# Altium schematic sheet 合体.schdoc
size A1
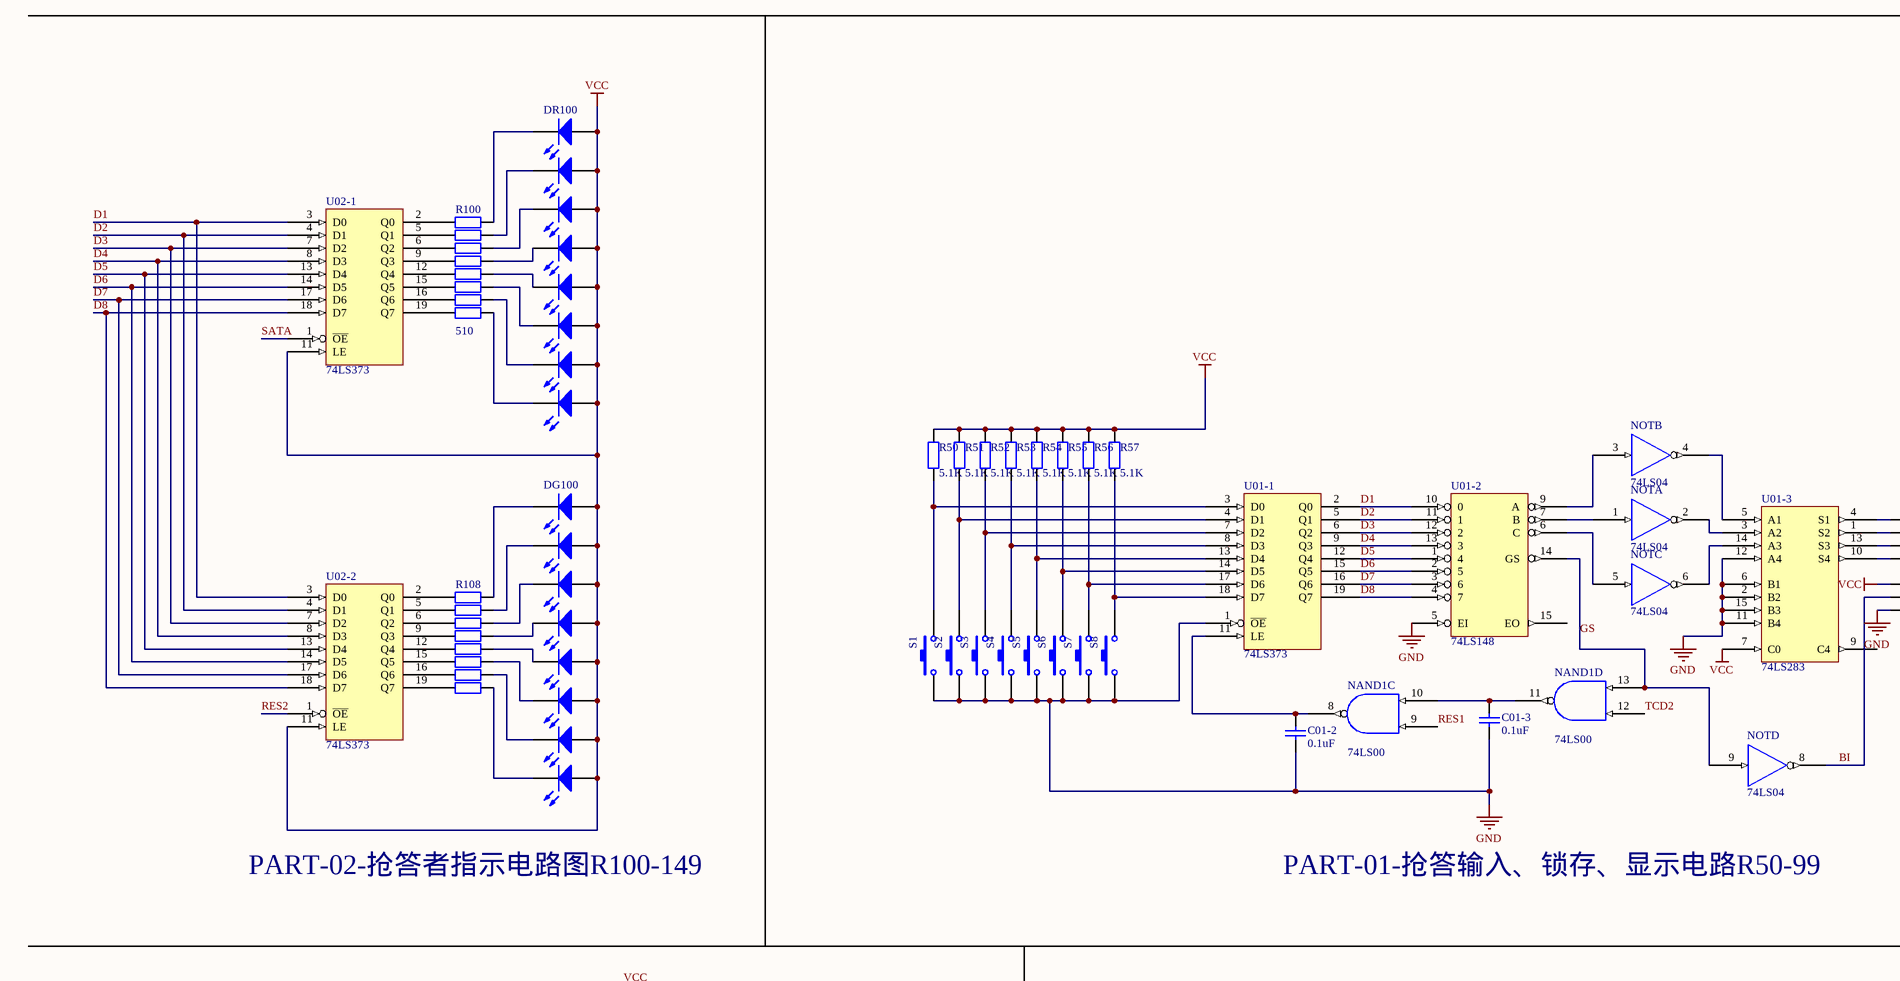
[diagram p0: 合体.schdoc, top left]
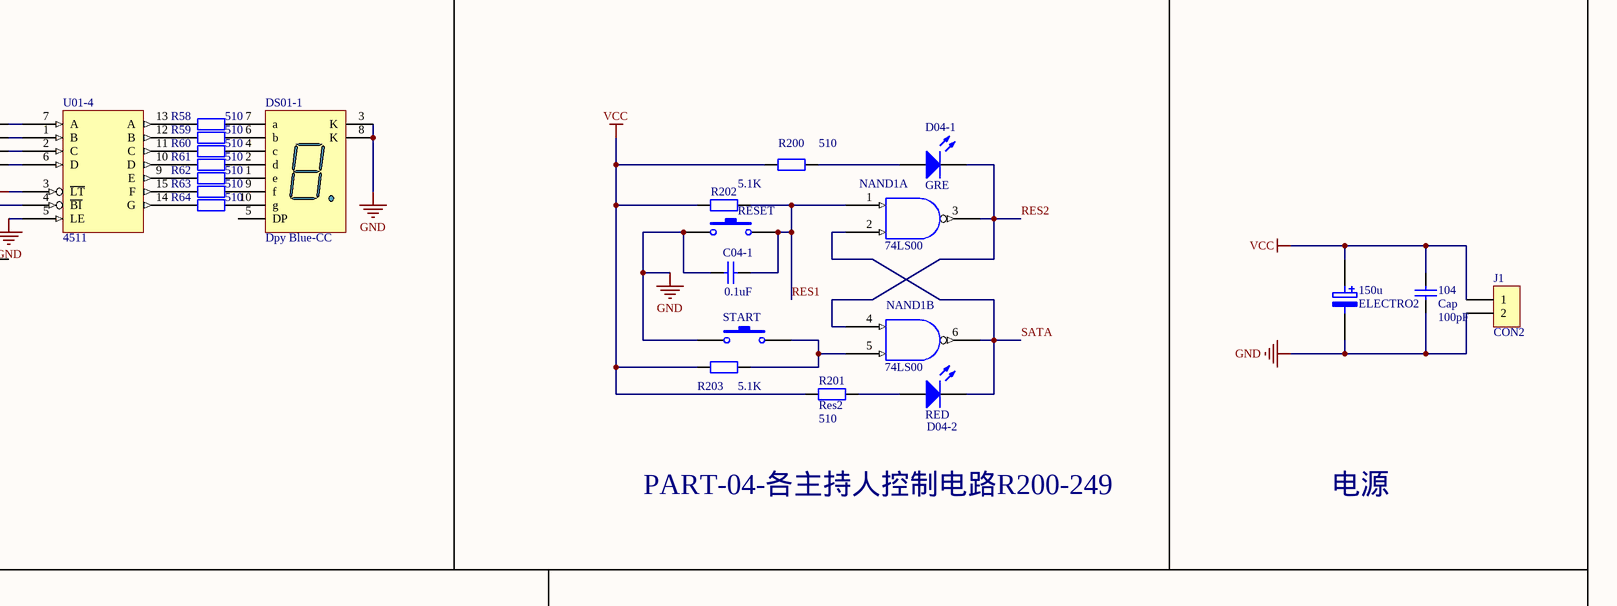
[diagram p1: 合体.schdoc, top right]
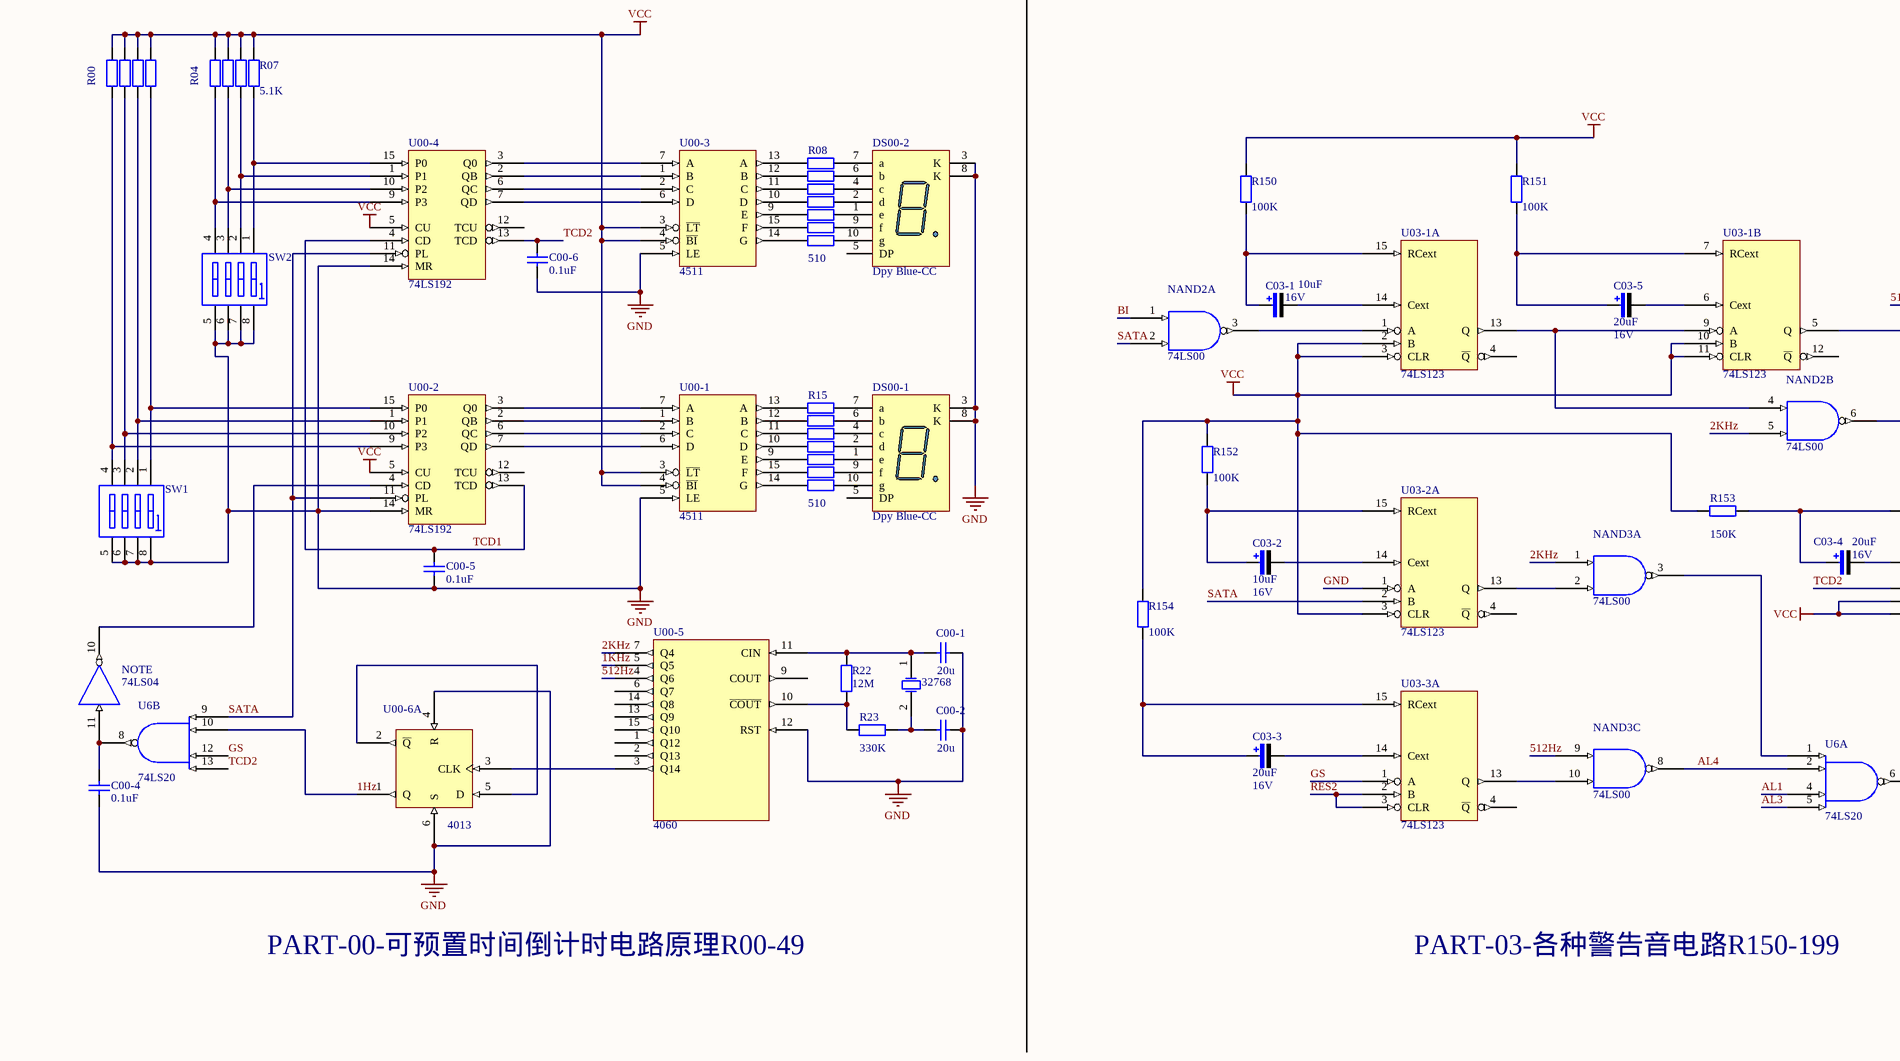
[diagram p2: 合体.schdoc, bottom left]
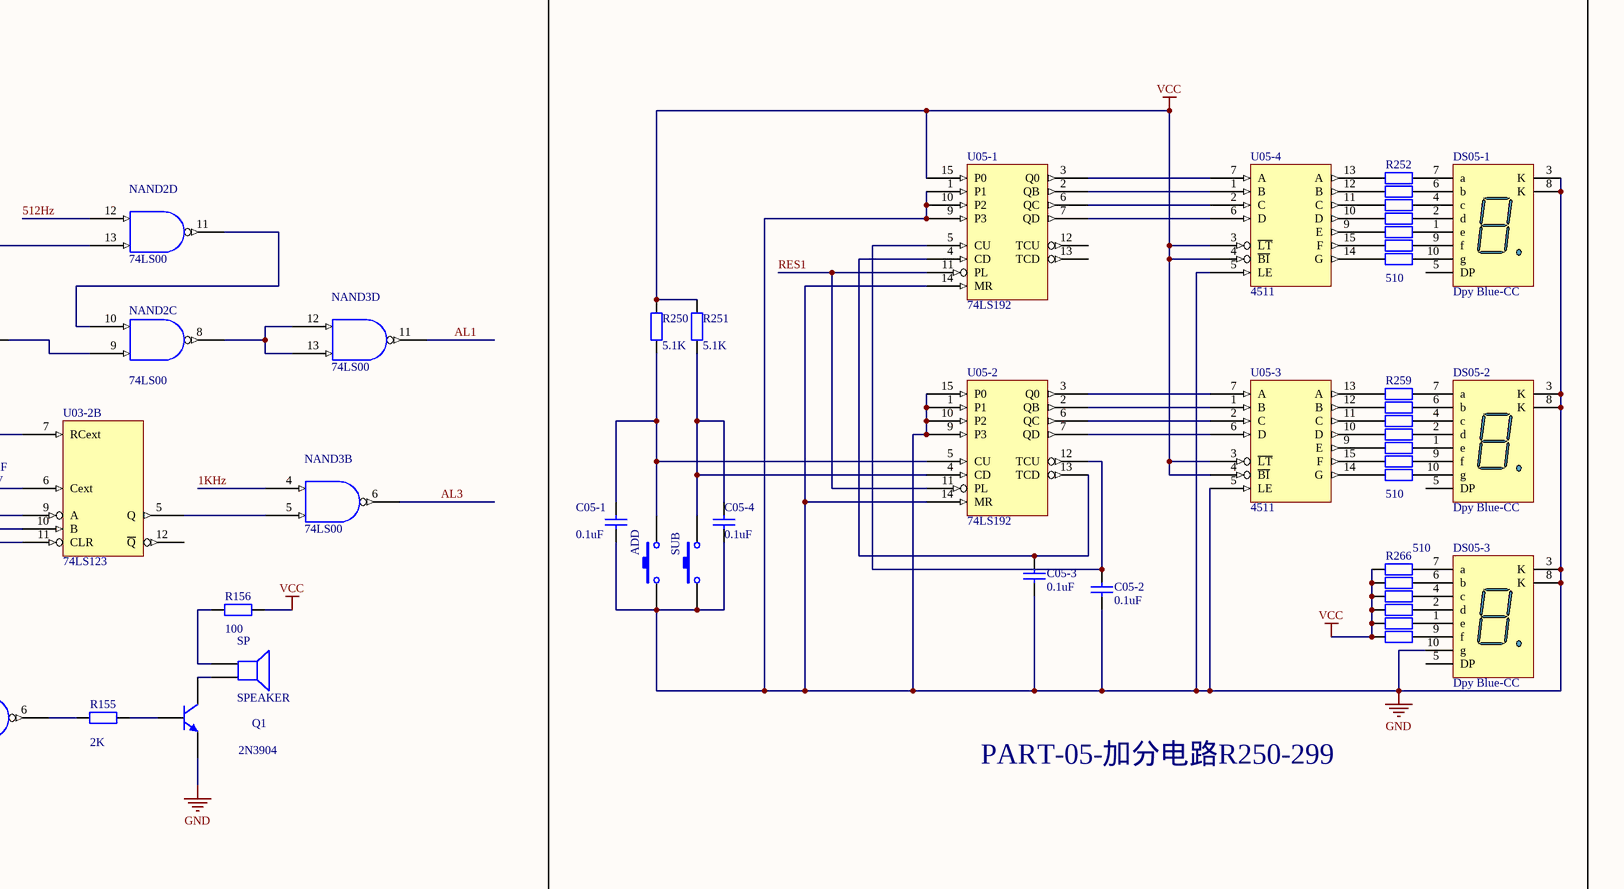
[diagram p3: 合体.schdoc, bottom right]

## Parts
104  Cap  value 100pF  [CAP0.2]
150u  ELECTRO2  [CAP-EL]
32768  XTAL  [XTAL-1]  (value not drawn)
ADD  SW-PB  [AN-S]  (value not drawn)
C00-1  value 20u  [CAP0.2]  (hidden comment: Cap)
C00-2  value 20u  [CAP0.2]  (hidden comment: Cap)
C00-4  value 0.1uF  [CAP0.2]  (hidden comment: Cap)
C00-5  value 0.1uF  [CAP0.2]  (hidden comment: Cap)
C00-6  value 0.1uF  [CAP0.2]  (hidden comment: Cap)
C01-2  value 0.1uF  [CAP0.2]  (hidden comment: Cap)
C01-3  value 0.1uF  [CAP0.2]  (hidden comment: Cap)
C03-1  value 10uF  Vol: 16V  [CAP-EL]  (hidden comment: Cap Pol)
C03-2  value 10uF  Vol: 16V  [CAP-EL]  (hidden comment: Cap Pol)
C03-3  value 20uF  Vol: 16V  [CAP-EL]  (hidden comment: Cap Pol)
C03-4  value 20uF  Vol: 16V  [CAP-EL]  (hidden comment: Cap Pol)
C03-5  value 20uF  Vol: 16V  [CAP-EL]  (hidden comment: Cap Pol)
C04-1  value 0.1uF  [CAP0.2]  (hidden comment: Cap)
C05-1  value 0.1uF  [CAP0.2]  (hidden comment: Cap)
C05-2  value 0.1uF  [CAP0.2]  (hidden comment: Cap)
C05-3  value 0.1uF  [CAP0.2]  (hidden comment: Cap)
C05-4  value 0.1uF  [CAP0.2]  (hidden comment: Cap)
D04-1  GRE  [LED-3]
D04-2  RED  [LED-3]
DG100  LED  [LED-3]  (value not drawn)
DG101  LED  [LED-3]  (value not drawn)
DG102  LED  [LED-3]  (value not drawn)
DG103  LED  [LED-3]  (value not drawn)
DG104  LED  [LED-3]  (value not drawn)
DG105  LED  [LED-3]  (value not drawn)
DG106  LED  [LED-3]  (value not drawn)
DG107  LED  [LED-3]  (value not drawn)
DR100  LED  [LED-3]  (value not drawn)
DR101  LED  [LED-3]  (value not drawn)
DR102  LED  [LED-3]  (value not drawn)
DR103  LED  [LED-3]  (value not drawn)
DR104  LED  [LED-3]  (value not drawn)
DR105  LED  [LED-3]  (value not drawn)
DR106  LED  [LED-3]  (value not drawn)
DR107  LED  [LED-3]  (value not drawn)
DS00-1  Dpy Blue-CC  [H]
DS00-2  Dpy Blue-CC  [H]
DS01-1  Dpy Blue-CC  [H]
DS05-1  Dpy Blue-CC  [H]
DS05-2  Dpy Blue-CC  [H]
DS05-3  Dpy Blue-CC  [H]
J1  CON2  [POWER PLUG2]
NAND1  74LS00  [DIP-14]  (parts A,B,C,D of 4)
NAND2  74LS00  [DIP-14]  (parts A,B,C,D of 4)
NAND3  74LS00  [DIP-14]  (parts A,B,C,D of 4)
NOT  74LS04  [DIP-14]  (parts A,B,C,D,E of 6)
Q1  2N3904  [NPN-2]
R00  Res2  [AXIAL-0.4]  (value not drawn)
R01  Res2  [AXIAL-0.4]  (value not drawn)
R02  Res2  [AXIAL-0.4]  (value not drawn)
R03  Res2  [AXIAL-0.4]  (value not drawn)
R04  Res2  [AXIAL-0.4]  (value not drawn)
R05  Res2  [AXIAL-0.4]  (value not drawn)
R06  Res2  [AXIAL-0.4]  (value not drawn)
R07  value 5.1K  [AXIAL-0.4]  (hidden comment: Res2)
R08  value 510  [AXIAL-0.4]  (hidden comment: Res2)
R09  Res2  [AXIAL-0.4]  (value not drawn)
R10  Res2  [AXIAL-0.4]  (value not drawn)
R11  Res2  [AXIAL-0.4]  (value not drawn)
R12  Res2  [AXIAL-0.4]  (value not drawn)
R13  Res2  [AXIAL-0.4]  (value not drawn)
R14  Res2  [AXIAL-0.4]  (value not drawn)
R15  value 510  [AXIAL-0.4]  (hidden comment: Res2)
R16  Res2  [AXIAL-0.4]  (value not drawn)
R17  Res2  [AXIAL-0.4]  (value not drawn)
R18  Res2  [AXIAL-0.4]  (value not drawn)
R19  Res2  [AXIAL-0.4]  (value not drawn)
R20  Res2  [AXIAL-0.4]  (value not drawn)
R21  Res2  [AXIAL-0.4]  (value not drawn)
R22  value 12M  [AXIAL-0.4]  (hidden comment: Res2)
R23  value 330K  [AXIAL-0.4]  (hidden comment: Res2)
R50  value 5.1K  [AXIAL-0.4]  (hidden comment: Res2)
R51  value 5.1K  [AXIAL-0.4]  (hidden comment: Res2)
R52  value 5.1K  [AXIAL-0.4]  (hidden comment: Res2)
R53  value 5.1K  [AXIAL-0.4]  (hidden comment: Res2)
R54  value 5.1K  [AXIAL-0.4]  (hidden comment: Res2)
R55  value 5.1K  [AXIAL-0.4]  (hidden comment: Res2)
R56  value 5.1K  [AXIAL-0.4]  (hidden comment: Res2)
R57  value 5.1K  [AXIAL-0.4]  (hidden comment: Res2)
R58  value 510  [AXIAL-0.4]  (hidden comment: Res2)
R59  value 510  [AXIAL-0.4]  (hidden comment: Res2)
R60  value 510  [AXIAL-0.4]  (hidden comment: Res2)
R61  value 510  [AXIAL-0.4]  (hidden comment: Res2)
R62  value 510  [AXIAL-0.4]  (hidden comment: Res2)
R63  value 510  [AXIAL-0.4]  (hidden comment: Res2)
R64  value 510  [AXIAL-0.4]  (hidden comment: Res2)
R100  value 510  [AXIAL-0.4]  (hidden comment: Res2)
R101  Res2  [AXIAL-0.4]  (value not drawn)
R102  Res2  [AXIAL-0.4]  (value not drawn)
R103  Res2  [AXIAL-0.4]  (value not drawn)
R104  Res2  [AXIAL-0.4]  (value not drawn)
R105  Res2  [AXIAL-0.4]  (value not drawn)
R106  Res2  [AXIAL-0.4]  (value not drawn)
R107  Res2  [AXIAL-0.4]  (value not drawn)
R108  Res2  [AXIAL-0.4]  (value not drawn)
R109  Res2  [AXIAL-0.4]  (value not drawn)
R110  Res2  [AXIAL-0.4]  (value not drawn)
R111  Res2  [AXIAL-0.4]  (value not drawn)
R112  Res2  [AXIAL-0.4]  (value not drawn)
R113  Res2  [AXIAL-0.4]  (value not drawn)
R114  Res2  [AXIAL-0.4]  (value not drawn)
R115  Res2  [AXIAL-0.4]  (value not drawn)
R150  value 100K  [AXIAL-0.4]  (hidden comment: Res2)
R151  value 100K  [AXIAL-0.4]  (hidden comment: Res2)
R152  value 100K  [AXIAL-0.4]  (hidden comment: Res2)
R153  value 150K  [AXIAL-0.4]  (hidden comment: Res2)
R154  value 100K  [AXIAL-0.4]  (hidden comment: Res2)
R155  value 2K  [AXIAL-0.4]  (hidden comment: Res2)
R156  value 100  [AXIAL-0.4]  (hidden comment: Res2)
R200  value 510  [AXIAL-0.4]  (hidden comment: Res2)
R201  Res2  value 510  [AXIAL-0.4]
R202  value 5.1K  [AXIAL-0.4]  (hidden comment: Res2)
R203  value 5.1K  [AXIAL-0.4]  (hidden comment: Res2)
R250  value 5.1K  [AXIAL-0.4]  (hidden comment: Res2)
R251  value 5.1K  [AXIAL-0.4]  (hidden comment: Res2)
R252  value 510  [AXIAL-0.4]  (hidden comment: Res2)
R253  Res2  [AXIAL-0.4]  (value not drawn)
R254  Res2  [AXIAL-0.4]  (value not drawn)
R255  Res2  [AXIAL-0.4]  (value not drawn)
R256  Res2  [AXIAL-0.4]  (value not drawn)
R257  Res2  [AXIAL-0.4]  (value not drawn)
R258  Res2  [AXIAL-0.4]  (value not drawn)
R259  value 510  [AXIAL-0.4]  (hidden comment: Res2)
R260  Res2  [AXIAL-0.4]  (value not drawn)
R261  Res2  [AXIAL-0.4]  (value not drawn)
R262  Res2  [AXIAL-0.4]  (value not drawn)
R263  Res2  [AXIAL-0.4]  (value not drawn)
R264  Res2  [AXIAL-0.4]  (value not drawn)
R265  Res2  [AXIAL-0.4]  (value not drawn)
R266  value 510  [AXIAL-0.4]  (hidden comment: Res2)
R267  Res2  [AXIAL-0.4]  (value not drawn)
R268  Res2  [AXIAL-0.4]  (value not drawn)
R269  Res2  [AXIAL-0.4]  (value not drawn)
R270  Res2  [AXIAL-0.4]  (value not drawn)
R271  Res2  [AXIAL-0.4]  (value not drawn)
RESET  SW-PB  [AN-S]  (value not drawn)
S1  SW-PB  [AN-S]  (value not drawn)
S2  SW-PB  [AN-S]  (value not drawn)
S3  SW-PB  [AN-S]  (value not drawn)
S4  SW-PB  [AN-S]  (value not drawn)
S5  SW-PB  [AN-S]  (value not drawn)
S6  SW-PB  [AN-S]  (value not drawn)
S7  SW-PB  [AN-S]  (value not drawn)
S8  SW-PB  [AN-S]  (value not drawn)
SP  SPEAKER  [RAD-0.2]
START  SW-PB  [AN-S]  (value not drawn)
SUB  SW-PB  [AN-S]  (value not drawn)
SW1  SW DIP-4  [DIP-8]  (value not drawn)
SW2  SW DIP-4  [DIP-8]  (value not drawn)
U00-1  4511  [DIP-16]
U00-2  74LS192  [DIP-16]
U00-3  4511  [DIP-16]
U00-4  74LS192  [DIP-16]
U00-5  4060  [DIP-16]
U00-6  4013  [DIP-14]  (part A of 2)
U01-1  74LS373  [DIP-20]
U01-2  74LS148  [DIP-16]
U01-3  74LS283  [DIP-16]
U01-4  4511  [DIP-16]
U02-1  74LS373  [DIP-20]
U02-2  74LS373  [DIP-20]
U03-1  74LS123  [DIP-16]  (parts A,B of 2)
U03-2  74LS123  [DIP-16]  (parts A,B of 2)
U03-3  74LS123  [DIP-16]  (part A of 2)
U05-1  74LS192  [DIP-16]
U05-2  74LS192  [DIP-16]
U05-3  4511  [DIP-16]
U05-4  4511  [DIP-16]
U6  74LS20  [DIP-14]  (parts A,B of 2)

## Nets
GND: 104.1 150u.2 ADD.1 C00-1.2 C00-2.2 C00-4.1 C00-5.1 C00-6.1 C01-2.1 C01-3.1 C04-1.1 C05-1.1 C05-2.1 C05-3.1 C05-4.1 DS00-1.3(K) DS00-1.8(K) DS00-2.3(K) DS00-2.8(K) DS01-1.3(K) DS01-1.8(K) DS05-1.3(K) DS05-1.8(K) DS05-2.3(K) DS05-2.8(K) DS05-3.3(K) DS05-3.8(K) DS05-3.10(g) J1.2 NAND1.7(GND) NAND2.7(GND) NAND3.7(GND) NOT.7(GND) Q1.1(E) RESET.1 S1.1 S2.1 S3.1 S4.1 S5.1 S6.1 S7.1 S8.1 START.1 SUB.1 SW1.5(B4) SW1.6(B3) SW1.7(B2) SW1.8(B1) SW2.5(B4) SW2.6(B3) SW2.7(B2) SW2.8(B1) U00-1.5(LE) U00-1.8(GND) U00-2.8(GND) U00-2.14(MR) U00-3.5(LE) U00-3.8(GND) U00-4.8(GND) U00-4.14(MR) U00-5.8(GND) U00-5.12(RST) U00-6.4(R) U00-6.6(S) U00-6.7(GND) U01-1.1(~{OE}) U01-1.10(GND) U01-2.5(EI) U01-2.8(GND) U01-3.2(B2) U01-3.6(B1) U01-3.8(GND) U01-3.11(B4) U01-3.12(A4) U01-3.15(B3) U01-4.5(LE) U01-4.8(GND) U02-1.10(GND) U02-2.10(GND) U03-1.8(GND) U03-2.1(A) U03-2.8(GND) U03-3.8(GND) U05-1.1(P1) U05-1.8(GND) U05-1.9(P3) U05-1.10(P2) U05-1.14(MR) U05-2.1(P1) U05-2.8(GND) U05-2.9(P3) U05-2.10(P2) U05-2.14(MR) U05-2.15(P0) U05-3.5(LE) U05-3.8(GND) U05-4.5(LE) U05-4.8(GND) U6.7(GND)
VCC: 104.2 150u.1 DG100.1(A) DG101.1(A) DG102.1(A) DG103.1(A) DG104.1(A) DG105.1(A) DG106.1(A) DG107.1(A) DR100.1(A) DR101.1(A) DR102.1(A) DR103.1(A) DR104.1(A) DR105.1(A) DR106.1(A) DR107.1(A) J1.1 NAND1.14(VCC) NAND2.14(VCC) NAND3.14(VCC) NOT.14(VCC) R00.1 R01.1 R02.1 R03.1 R04.1 R05.1 R06.1 R07.1 R50.2 R51.2 R52.2 R53.2 R54.2 R55.2 R56.2 R57.2 R150.2 R151.2 R152.2 R153.1 R154.2 R156.2 R200.1 R201.1 R202.1 R203.1 R250.2 R251.2 R266.1 R267.1 R268.1 R269.1 R270.1 R271.1 U00-1.3(~{LT}) U00-1.4(~{BI}) U00-1.16(VCC) U00-2.5(CU) U00-2.16(VCC) U00-3.3(~{LT}) U00-3.4(~{BI}) U00-3.16(VCC) U00-4.5(CU) U00-4.16(VCC) U00-5.16(VCC) U00-6.14(VCC) U01-1.20(VCC) U01-2.16(VCC) U01-3.7(C0) U01-3.16(VCC) U01-4.3(~{LT}) U01-4.16(VCC) U02-1.11(LE) U02-1.20(VCC) U02-2.11(LE) U02-2.20(VCC) U03-1.2(B) U03-1.3(CLR) U03-1.10(B) U03-1.11(CLR) U03-1.16(VCC) U03-2.3(CLR) U03-2.10(B) U03-2.11(CLR) U03-2.16(VCC) U03-3.16(VCC) U05-1.15(P0) U05-1.16(VCC) U05-2.16(VCC) U05-3.3(~{LT}) U05-3.4(~{BI}) U05-3.16(VCC) U05-4.3(~{LT}) U05-4.4(~{BI}) U05-4.16(VCC) U6.14(VCC)
1Hz: U00-6.1(Q) U6.10
1KHz: NAND3.4 U00-5.5(Q5)
2KHz: NAND2.5 NAND3.1 U00-5.7(Q4)
512Hz: NAND2.12 NAND3.9 U00-5.4(Q6)
AL1: NAND3.11 U6.4
AL3: NAND3.6 U6.5
AL4: NAND3.8 U6.2
BI: NAND2.1 NOT.8 U01-4.4(~{BI})
D1: U01-1.2(Q0) U01-2.10(0) U02-1.3(D0) U02-2.3(D0)
D2: U01-1.5(Q1) U01-2.11(1) U02-1.4(D1) U02-2.4(D1)
D3: U01-1.6(Q2) U01-2.12(2) U02-1.7(D2) U02-2.7(D2)
D4: U01-1.9(Q3) U01-2.13(3) U02-1.8(D3) U02-2.8(D3)
D5: U01-1.12(Q4) U01-2.1(4) U02-1.13(D4) U02-2.13(D4)
D6: U01-1.15(Q5) U01-2.2(5) U02-1.14(D5) U02-2.14(D5)
D7: U01-1.16(Q6) U01-2.3(6) U02-1.17(D6) U02-2.17(D6)
D8: U01-1.19(Q7) U01-2.4(7) U02-1.18(D7) U02-2.18(D7)
GS: NAND1.13 NOT.9 U01-2.14(GS) U03-3.1(A) U6.12
RES1: C04-1.2 NAND1.1 NAND1.9 R202.2 RESET.2 U05-1.11(PL) U05-2.11(PL)
RES2: D04-1.2(K) NAND1.3 NAND1.4 U02-2.1(~{OE}) U03-3.2(B) U03-3.3(CLR)
SATA: D04-2.2(K) NAND1.2 NAND1.6 NAND2.2 U00-2.11(PL) U00-4.11(PL) U02-1.1(~{OE}) U03-2.2(B) U6.9
TCD1: C00-5.2 U00-2.13(TCD) U00-4.4(CD)
TCD2: C00-6.2 NAND1.12 U00-4.13(TCD) U03-2.9(A) U6.13
Net32768_1: 32768.1(OSC1) C00-1.1 R22.2 U00-5.11(CIN)
Net32768_2: 32768.2(OSC2) C00-2.1 R23.2
NetADD_2: ADD.2 C05-1.2 R250.1 U05-2.5(CU)
NetC00-4_2: C00-4.2 NOT.11 U6.8
NetC01-2_2: C01-2.2 NAND1.8 U01-1.11(LE)
NetC01-3_2: C01-3.2 NAND1.10 NAND1.11
NetC03-1_1: C03-1.1 R150.1 U03-1.15(RCext)
NetC03-1_2: C03-1.2 U03-1.14(Cext)
NetC03-2_1: C03-2.1 R152.1 U03-2.15(RCext)
NetC03-2_2: C03-2.2 U03-2.14(Cext)
NetC03-3_1: C03-3.1 R154.1 U03-3.15(RCext)
NetC03-3_2: C03-3.2 U03-3.14(Cext)
NetC03-4_1: C03-4.1 R153.2 U03-2.7(RCext)
NetC03-4_2: C03-4.2 U03-2.6(Cext)
NetC03-5_1: C03-5.1 R151.1 U03-1.7(RCext)
NetC03-5_2: C03-5.2 U03-1.6(Cext)
NetC05-2_2: C05-2.2 U05-1.5(CU) U05-2.12(TCU)
NetC05-3_2: C05-3.2 U05-1.4(CD) U05-2.13(TCD)
NetC05-4_2: C05-4.2 R251.1 SUB.2 U05-2.4(CD)
NetD04-1_1: D04-1.1(A) R200.2
NetD04-2_1: D04-2.1(A) R201.2
NetDG100_2: DG100.2(K) R108.2
NetDG101_2: DG101.2(K) R109.2
NetDG102_2: DG102.2(K) R110.2
NetDG103_2: DG103.2(K) R111.2
NetDG104_2: DG104.2(K) R112.2
NetDG105_2: DG105.2(K) R113.2
NetDG106_2: DG106.2(K) R114.2
NetDG107_2: DG107.2(K) R115.2
NetDR100_2: DR100.2(K) R100.2
NetDR101_2: DR101.2(K) R101.2
NetDR102_2: DR102.2(K) R102.2
NetDR103_2: DR103.2(K) R103.2
NetDR104_2: DR104.2(K) R104.2
NetDR105_2: DR105.2(K) R105.2
NetDR106_2: DR106.2(K) R106.2
NetDR107_2: DR107.2(K) R107.2
NetDS00-1_1: DS00-1.1(e) R19.2
NetDS00-1_2: DS00-1.2(d) R18.2
NetDS00-1_4: DS00-1.4(c) R17.2
NetDS00-1_6: DS00-1.6(b) R16.2
NetDS00-1_7: DS00-1.7(a) R15.2
NetDS00-1_9: DS00-1.9(f) R20.2
NetDS00-1_10: DS00-1.10(g) R21.2
NetDS00-2_1: DS00-2.1(e) R12.2
NetDS00-2_2: DS00-2.2(d) R11.2
NetDS00-2_4: DS00-2.4(c) R10.2
NetDS00-2_6: DS00-2.6(b) R09.2
NetDS00-2_7: DS00-2.7(a) R08.2
NetDS00-2_9: DS00-2.9(f) R13.2
NetDS00-2_10: DS00-2.10(g) R14.2
NetDS01-1_1: DS01-1.1(e) R62.2
NetDS01-1_2: DS01-1.2(d) R61.2
NetDS01-1_4: DS01-1.4(c) R60.2
NetDS01-1_6: DS01-1.6(b) R59.2
NetDS01-1_7: DS01-1.7(a) R58.2
NetDS01-1_9: DS01-1.9(f) R63.2
NetDS01-1_10: DS01-1.10(g) R64.2
NetDS05-1_1: DS05-1.1(e) R256.2
NetDS05-1_2: DS05-1.2(d) R255.2
NetDS05-1_4: DS05-1.4(c) R254.2
NetDS05-1_6: DS05-1.6(b) R253.2
NetDS05-1_7: DS05-1.7(a) R252.2
NetDS05-1_9: DS05-1.9(f) R257.2
NetDS05-1_10: DS05-1.10(g) R258.2
NetDS05-2_1: DS05-2.1(e) R263.2
NetDS05-2_2: DS05-2.2(d) R262.2
NetDS05-2_4: DS05-2.4(c) R261.2
NetDS05-2_6: DS05-2.6(b) R260.2
NetDS05-2_7: DS05-2.7(a) R259.2
NetDS05-2_9: DS05-2.9(f) R264.2
NetDS05-2_10: DS05-2.10(g) R265.2
NetDS05-3_1: DS05-3.1(e) R270.2
NetDS05-3_2: DS05-3.2(d) R269.2
NetDS05-3_4: DS05-3.4(c) R268.2
NetDS05-3_6: DS05-3.6(b) R267.2
NetDS05-3_7: DS05-3.7(a) R266.2
NetDS05-3_9: DS05-3.9(f) R271.2
NetNAND1_5: NAND1.5 R203.2 START.2
NetNAND2_3: NAND2.3 U03-1.1(A)
NetNAND2_4: NAND2.4 U03-1.9(A) U03-1.13(Q)
NetNAND2_6: NAND2.6 NAND2.9
NetNAND2_8: NAND2.8 NAND3.12 NAND3.13
NetNAND2_10: NAND2.10 NAND2.11
NetNAND2_13: NAND2.13 U03-1.5(Q)
NetNAND3_2: NAND3.2 U03-2.13(Q)
NetNAND3_3: NAND3.3 U6.1
NetNAND3_5: NAND3.5 U03-2.5(Q)
NetNAND3_10: NAND3.10 U03-3.13(Q)
NetNOT_1: NOT.1 U01-2.7(B)
NetNOT_2: NOT.2 U01-3.3(A2)
NetNOT_3: NOT.3 U01-2.9(A)
NetNOT_4: NOT.4 U01-3.5(A1)
NetNOT_5: NOT.5 U01-2.6(C)
NetNOT_6: NOT.6 U01-3.14(A3)
NetNOT_10: NOT.10 U00-2.4(CD)
NetQ1_2: Q1.2(B) R155.2
NetQ1_3: Q1.3(C) SP.2
NetR00_2: R00.2 SW1.4(A4) U00-2.9(P3)
NetR01_2: R01.2 SW1.3(A3) U00-2.10(P2)
NetR02_2: R02.2 SW1.2(A2) U00-2.1(P1)
NetR03_2: R03.2 SW1.1(A1) U00-2.15(P0)
NetR04_2: R04.2 SW2.4(A4) U00-4.9(P3)
NetR05_2: R05.2 SW2.3(A3) U00-4.10(P2)
NetR06_2: R06.2 SW2.2(A2) U00-4.1(P1)
NetR07_2: R07.2 SW2.1(A1) U00-4.15(P0)
NetR08_1: R08.1 U00-3.13(A)
NetR09_1: R09.1 U00-3.12(B)
NetR10_1: R10.1 U00-3.11(C)
NetR11_1: R11.1 U00-3.10(D)
NetR12_1: R12.1 U00-3.9(E)
NetR13_1: R13.1 U00-3.15(F)
NetR14_1: R14.1 U00-3.14(G)
NetR15_1: R15.1 U00-1.13(A)
NetR16_1: R16.1 U00-1.12(B)
NetR17_1: R17.1 U00-1.11(C)
NetR18_1: R18.1 U00-1.10(D)
NetR19_1: R19.1 U00-1.9(E)
NetR20_1: R20.1 U00-1.15(F)
NetR21_1: R21.1 U00-1.14(G)
NetR22_1: R22.1 R23.1 U00-5.10(~{COUT})
NetR50_1: R50.1 S1.2 U01-1.3(D0)
NetR51_1: R51.1 S2.2 U01-1.4(D1)
NetR52_1: R52.1 S3.2 U01-1.7(D2)
NetR53_1: R53.1 S4.2 U01-1.8(D3)
NetR54_1: R54.1 S5.2 U01-1.13(D4)
NetR55_1: R55.1 S6.2 U01-1.14(D5)
NetR56_1: R56.1 S7.2 U01-1.17(D6)
NetR57_1: R57.1 S8.2 U01-1.18(D7)
NetR58_1: R58.1 U01-4.13(A)
NetR59_1: R59.1 U01-4.12(B)
NetR60_1: R60.1 U01-4.11(C)
NetR61_1: R61.1 U01-4.10(D)
NetR62_1: R62.1 U01-4.9(E)
NetR63_1: R63.1 U01-4.15(F)
NetR64_1: R64.1 U01-4.14(G)
NetR100_1: R100.1 U02-1.2(Q0)
NetR101_1: R101.1 U02-1.5(Q1)
NetR102_1: R102.1 U02-1.6(Q2)
NetR103_1: R103.1 U02-1.9(Q3)
NetR104_1: R104.1 U02-1.12(Q4)
NetR105_1: R105.1 U02-1.15(Q5)
NetR106_1: R106.1 U02-1.16(Q6)
NetR107_1: R107.1 U02-1.19(Q7)
NetR108_1: R108.1 U02-2.2(Q0)
NetR109_1: R109.1 U02-2.5(Q1)
NetR110_1: R110.1 U02-2.6(Q2)
NetR111_1: R111.1 U02-2.9(Q3)
NetR112_1: R112.1 U02-2.12(Q4)
NetR113_1: R113.1 U02-2.15(Q5)
NetR114_1: R114.1 U02-2.16(Q6)
NetR115_1: R115.1 U02-2.19(Q7)
NetR155_1: R155.1 U6.6
NetR156_1: R156.1 SP.1
NetR252_1: R252.1 U05-4.13(A)
NetR253_1: R253.1 U05-4.12(B)
NetR254_1: R254.1 U05-4.11(C)
NetR255_1: R255.1 U05-4.10(D)
NetR256_1: R256.1 U05-4.9(E)
NetR257_1: R257.1 U05-4.15(F)
NetR258_1: R258.1 U05-4.14(G)
NetR259_1: R259.1 U05-3.13(A)
NetR260_1: R260.1 U05-3.12(B)
NetR261_1: R261.1 U05-3.11(C)
NetR262_1: R262.1 U05-3.10(D)
NetR263_1: R263.1 U05-3.9(E)
NetR264_1: R264.1 U05-3.15(F)
NetR265_1: R265.1 U05-3.14(G)
NetU00-1_1: U00-1.1(B) U00-2.2(QB)
NetU00-1_2: U00-1.2(C) U00-2.6(QC)
NetU00-1_6: U00-1.6(D) U00-2.7(QD)
NetU00-1_7: U00-1.7(A) U00-2.3(Q0)
NetU00-3_1: U00-3.1(B) U00-4.2(QB)
NetU00-3_2: U00-3.2(C) U00-4.6(QC)
NetU00-3_6: U00-3.6(D) U00-4.7(QD)
NetU00-3_7: U00-3.7(A) U00-4.3(Q0)
NetU00-5_3: U00-5.3(Q14) U00-6.3(CLK)
NetU00-6_2: U00-6.2(~{Q}) U00-6.5(D)
NetU01-3_1: U01-3.1(S2) U01-4.1(B)
NetU01-3_4: U01-3.4(S1) U01-4.7(A)
NetU01-3_10: U01-3.10(S4) U01-4.6(D)
NetU01-3_13: U01-3.13(S3) U01-4.2(C)
NetU05-1_2: U05-1.2(QB) U05-4.1(B)
NetU05-1_3: U05-1.3(Q0) U05-4.7(A)
NetU05-1_6: U05-1.6(QC) U05-4.2(C)
NetU05-1_7: U05-1.7(QD) U05-4.6(D)
NetU05-2_2: U05-2.2(QB) U05-3.1(B)
NetU05-2_3: U05-2.3(Q0) U05-3.7(A)
NetU05-2_6: U05-2.6(QC) U05-3.2(C)
NetU05-2_7: U05-2.7(QD) U05-3.6(D)

Not connected (* = marked no-connect by the designer): DS00-1 5(DP); DS00-2 5(DP); DS01-1 5(DP); DS05-1 5(DP); DS05-2 5(DP); DS05-3 5(DP); U00-2 12(TCU); U00-4 12(TCU); U00-5 1(Q12) 2(Q13) 6(Q7) 9(COUT) 13(Q9) 14(Q8) 15(Q10); U01-2 15(EO); U01-3 9(C4); U03-1 4(~{Q}) 12(~{Q}); U03-2 4(~{Q}) 12(~{Q}); U03-3 4(~{Q}); U05-1 12(TCU) 13(TCD)

## Notes on the sheet
- PART-02-抢答者指示电路图R100-149
- PART-01-抢答输入、锁存、显示电路R50-99
- PART-04-各主持人控制电路R200-249
- 电源
- PART-05-加分电路R250-299
- PART-00-可预置时间倒计时电路原理R00-49
- PART-03-各种警告音电路R150-199

## Library data of the parts
104 C00-1 C00-2 C00-4-C00-6 C01-2 C01-3 C04-1 C05-1-C05-4 = Cap: Capacitor; Published: 8-Jun-2000; LatestRevisionDate: 17-Jul-2002; LatestRevisionNote: Re-released for DXP Platform.; PackageReference: RAD-0.3; Publisher: Altium Limited
150u = ELECTRO2: Electrolytic Capacitor
32768 = XTAL: Crystal Oscillator; Published: 8-Jun-2000; LatestRevisionDate: 17-Jul-2002; LatestRevisionNote: Re-released for DXP Platform.; PackageReference: R38; Publisher: Altium Limited
ADD RESET S1-S8 START SUB = SW-PB: Switch; Published: 24-Mar-1999; LatestRevisionDate: 17-Jul-2002; LatestRevisionNote: Re-released for DXP Platform.; PackageReference: SPST-2; Publisher: Altium Limited
C03-1-C03-5 = Cap Pol: 极性电解电容; Published: 8-Jun-2000; LatestRevisionDate: 17-Jul-2002; LatestRevisionNote: Re-released for DXP Platform.; PackageReference: RB7.6-15; Publisher: Altium Limited
D04-1 D04-2 = LED1: Typical RED GaAs LED; Published: 8-Jun-2000; LatestRevisionDate: 08-Jul-2005; LatestRevisionNote: Mech Layer 1 removed.; PackageReference: LED-1; Publisher: Altium Limited
DG100-DG107 DR100-DR107 = LED0: Typical INFRARED GaAs LED; Published: 8-Jun-2000; LatestRevisionDate: 08-Jul-2005; LatestRevisionNote: Mech Layer 1 removed.; PackageReference: LED-0; Publisher: Altium Limited
DS00-1 DS00-2 DS01-1 DS05-1-DS05-3 = Dpy Blue-CC: 14.2 mm General Purpose Blue 7-Segment Display: CC, RH DP, Gray Surface; MinimumIntensity: 2020 ucd; Note: IF = 10 mA; Published: 8-Jun-2000; LatestRevisionDate: 17-Dec-2003; LatestRevisionNote: Schematic revised, PCB Footprint replaced.; DatasheetDocument: 24-Sep-2002; PackageDocument: 24-Sep-2002; PackageReference: H; Publisher: Altium Limited; Colour: Blue; ComponentLink1Description: Manufacturer Link; ComponentLink1URL: http://www.agilent.com/
J1 = CON2: Connector
Q1 = 2N3904: NPN General Purpose Amplifier; Published: 8-Jun-2000; LatestRevisionDate: 15-Jan-2003; LatestRevisionNote: PCB Footprint 'BCY-W3/D4.7' replaced; DatasheetDocument: 1997; PackageDocument: Sep-1998; PackageReference: TO-92A; Publisher: Altium Limited; Code_JEDEC: TO-92A; ComponentLink1Description: Manufacturer Link; ComponentLink1URL: http://www.fairchildsemi.com/; ComponentLink2Description: Datasheet; ComponentLink2URL: http://www.fairchildsemi.com/ds/2N%2F2N3904.pdf
R00 R01 R02 R03 R04 R05 R06 = Res2: Resistor; Value: 5.1K; Published: 8-Jun-2000; LatestRevisionDate: 17-Jul-2002; LatestRevisionNote: Re-released for DXP Platform.; PackageReference: AXIAL-0.4; Publisher: Altium Limited
R07 R08 R15 R22 R23 R50-R64 R100 R150-R156 R200-R203 R250-R252 R259 R266 = Res2: Resistor; Published: 8-Jun-2000; LatestRevisionDate: 17-Jul-2002; LatestRevisionNote: Re-released for DXP Platform.; PackageReference: AXIAL-0.4; Publisher: Altium Limited
R09-R14 R16-R21 R101-R115 R253-R258 R260-R265 R267-R271 = Res2: Resistor; Value: 510; Published: 8-Jun-2000; LatestRevisionDate: 17-Jul-2002; LatestRevisionNote: Re-released for DXP Platform.; PackageReference: AXIAL-0.4; Publisher: Altium Limited
SW1 SW2 = SW DIP-4: DIP Switch, 4 Position, SPST; Published: 24-Mar-1999; LatestRevisionDate: 17-Jul-2002; LatestRevisionNote: Re-released for DXP Platform.; PackageReference: SO8; Publisher: Altium Limited; Code_JEDEC: MS-012-AA; Code_IPC: SO8
U00-2 U00-4 U05-1 U05-2 = 74HC192